# EAGLE design WLED MINI v0.92 (EAGLE 9.3.2)
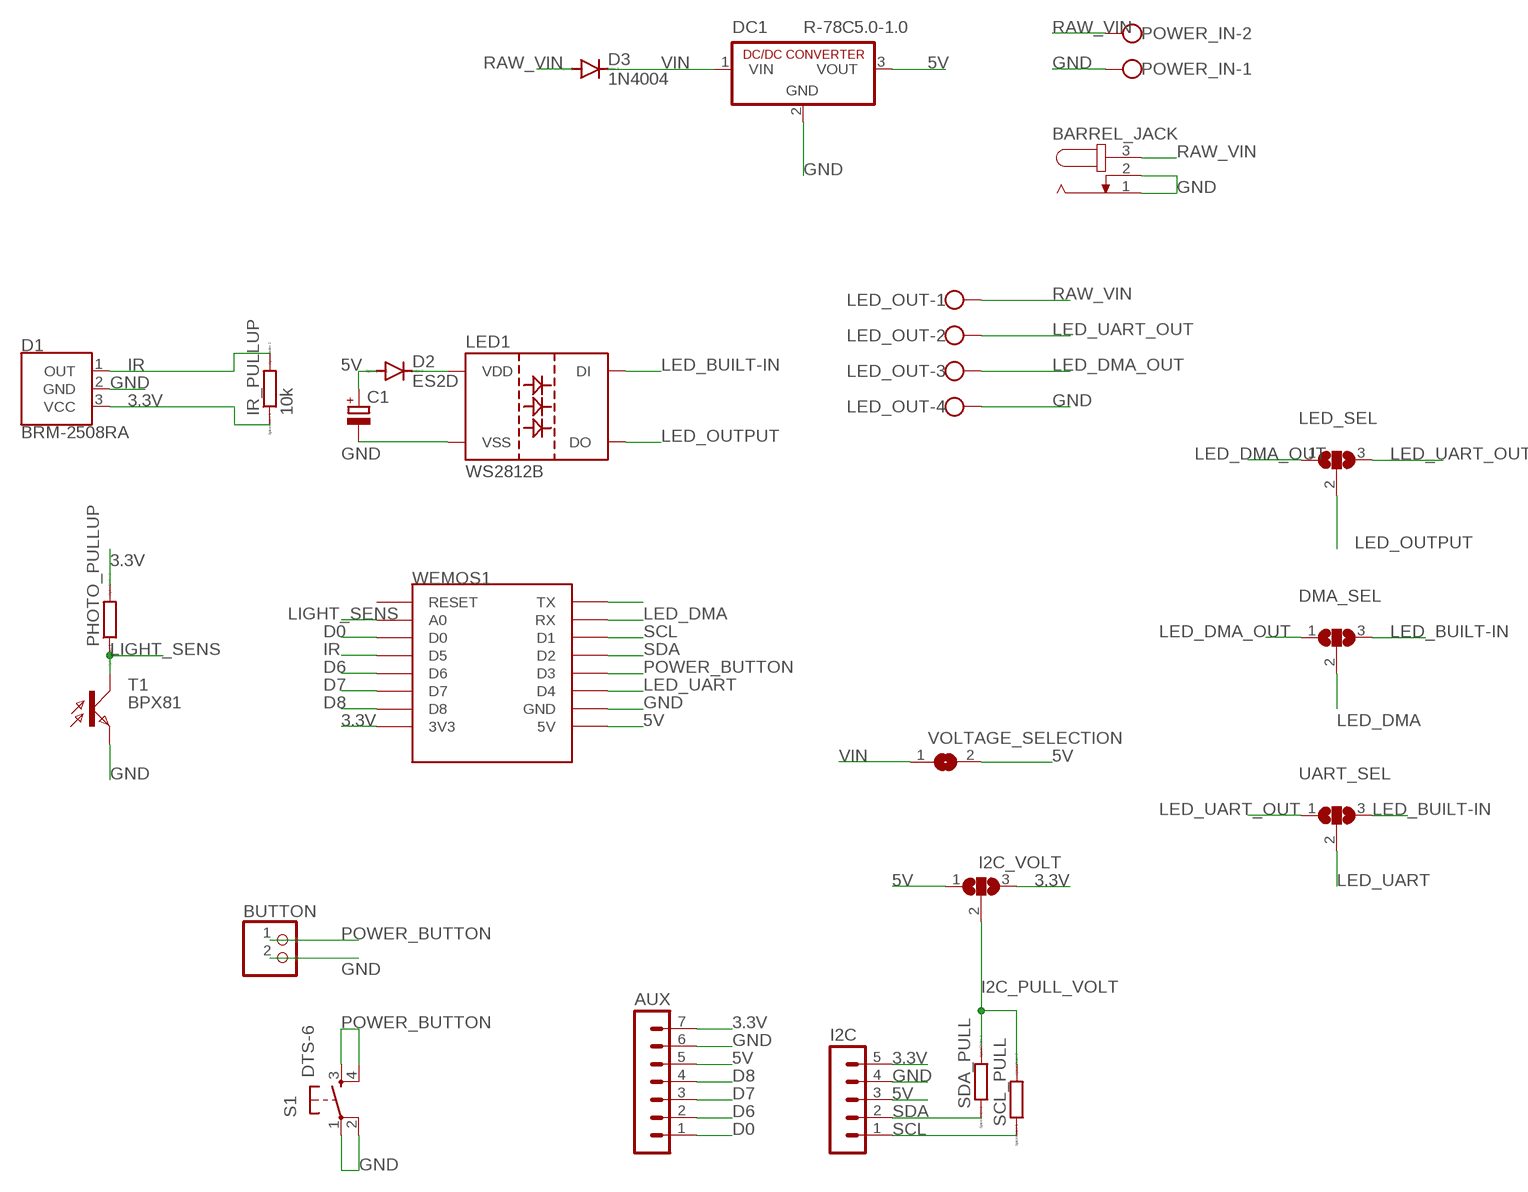
[diagram p0: schematic, sheet 1]

## Parts
AUX  MA07-1  [MA07-1]
BARREL_JACK  JACK-PLUG0  [SPC4077]
BUTTON  PINHD-1X2  [1X02]
C1  CPOL-EUE2.5-7  [E2,5-7]
D1  BRM-2508RA  [BRM-2508]
D2  ES2D  [SMB]
D3  1N4004  [DO41-10]
DC1  R-78C5.0-1.0  [SIP3]
DMA_SEL  SJ2W  [SJ_2]
I2C  MA05-1  [MA05-1]
I2C_VOLT  SJ2W  [SJ_2]
IR_PULLUP  10k  R0204/7  [0204/7]
LED1  WS2812B  [WS2812B]
LED_OUT  W237-4  [W237-4]
LED_SEL  SJ2W  [SJ_2]
PHOTO_PULLUP  R0204/7  [0204/7]
POWER_IN  W237-102  [W237-102]
S1  DTS-6  [DTS-6]
SCL_PULL  R0204/7  [0204/7]
SDA_PULL  R0204/7  [0204/7]
T1  BPX81  [BPX81]
UART_SEL  SJ2W  [SJ_2]
VOLTAGE_SELECTION  SJ  [SJ]
WEMOS1  WEMOS-D1-MINI  [WEMOS-D1-MINI]

## Nets
3.3V: AUX.7 D1.3(VCC) I2C.5 I2C_VOLT.3 IR_PULLUP.1 PHOTO_PULLUP.2 WEMOS1.3V3
5V [power]: AUX.5 C1.+ D2.A DC1.3(VOUT) I2C.3 I2C_VOLT.1 VOLTAGE_SELECTION.2 WEMOS1.5V
D0: AUX.1 WEMOS1.D0
D6: AUX.2 WEMOS1.D6
D7: AUX.3 WEMOS1.D7
D8: AUX.4 WEMOS1.D8
GND [power]: AUX.6 BARREL_JACK.1 BARREL_JACK.2 BUTTON.2 C1.- D1.2(GND) DC1.2(GND) I2C.4 LED1.3(VSS) LED_OUT.4 POWER_IN.1 S1.1 S1.2 T1.E WEMOS1.GND
I2C_PULL_VOLT: I2C_VOLT.2 SCL_PULL.2 SDA_PULL.2
IR: D1.1(OUT) IR_PULLUP.2 WEMOS1.D5
LED_BUILT-IN: DMA_SEL.3 LED1.4(DI) UART_SEL.3
LED_DMA: DMA_SEL.2 WEMOS1.RX
LED_DMA_OUT: DMA_SEL.1 LED_OUT.3 LED_SEL.1
LED_OUTPUT: LED1.2(DO) LED_SEL.2
LED_UART: UART_SEL.2 WEMOS1.D4
LED_UART_OUT: LED_OUT.2 LED_SEL.3 UART_SEL.1
LIGHT_SENS: PHOTO_PULLUP.1 T1.C WEMOS1.A0
N$1: WEMOS1.TX
N$2: D2.C LED1.1(VDD)
POWER_BUTTON: BUTTON.1 S1.3 S1.4 WEMOS1.D3
RAW_VIN [power]: BARREL_JACK.3 D3.A LED_OUT.1 POWER_IN.2
SCL: I2C.1 SCL_PULL.1 WEMOS1.D1
SDA: I2C.2 SDA_PULL.1 WEMOS1.D2
VIN: D3.C DC1.1(VIN) VOLTAGE_SELECTION.1
Unconnected: WEMOS1.RESET

## Library data of the parts
AUX = con-lstb:MA07-1: PIN HEADER; OC_FARNELL: unknown; OC_NEWARK: unknown
BARREL_JACK = con-jack:JACK-PLUG: DC POWER JACK Power Jack, DC, Right Angle, Through Hole, Rated 5A at 16VDC, PC Terminals Distributor: Farnell (www.Farnell.de) Drawing: 84N1161.pdf / 84N1162.pdf Manufacturer: SPC Technology (www.spctechnology.com) Type: SPC4077 / SPC 4078; OC_FARNELL: unknown; OC_NEWARK: unknown
BUTTON = pinhead:PINHD-1X2: PIN HEADER
C1 = rcl:CPOL-EU: POLARIZED CAPACITOR, European symbol; SPICEPREFIX: C
D1 = SparkFun-Sensors:BRM-2508: BRM-2508 IR Receiver Module 2.7V/5.5V IR Receiver with Low Power Consumption, High-immunity Against Ambient Light. Example Datasheet <http://www.sinoskysun.com/upload/20110512/201105120447164615.PDF>; PROD_ID: COMP-12059
D2 = diode:ES2D: DIODE super fast rectifier, 2 A
D3 = diode:1N4004: DIODE general purpose rectifier, 1 A
DC1 = dc-dc-converter:R-78C*-1.0: INNOLINE DC/DC-Converter 1.0 AMP SIP3 Single Output Source: Data sheet <http://www.mikrocontroller.net/attachment/150645/157764-da-01-en-DC_DC_WANDLER_R_78C5_0_1_0.pdf>
DMA_SEL I2C_VOLT LED_SEL UART_SEL = jumper:SJ2W: SMD solder JUMPER
I2C = con-lstb:MA05-1: PIN HEADER; OC_FARNELL: unknown; OC_NEWARK: unknown
IR_PULLUP PHOTO_PULLUP SCL_PULL SDA_PULL = eagle-ltspice:R: RESISTOR, European symbol; SPICEMODEL: NONE; SPICEPREFIX: R
LED1 = WS2812:WS2812B
LED_OUT = con-wago-500:W237-4: WAGO SCREW CLAMP; OC_FARNELL: unknown; OC_NEWARK: unknown
POWER_IN = con-wago-500:W237-102: WAGO SCREW CLAMP; MPN: 237-102; OC_FARNELL: unknown; OC_NEWARK: 70K9898
S1 = switch-tact:DTS-6
T1 = opto-trans-siemens:BPX81: PHOTO TRANSISTOR; OC_FARNELL: unknown; OC_NEWARK: unknown
VOLTAGE_SELECTION = jumper:SJ: SMD solder JUMPER
WEMOS1 = esp8266modules:WEMOS-D1-MINI: WeMos.cc D1 mini ESP8266 module

## Net classes
0 default: width 0.508 mm, clearance 0.254 mm
1 power: width 0.813 mm, clearance 0.33 mm

## Board
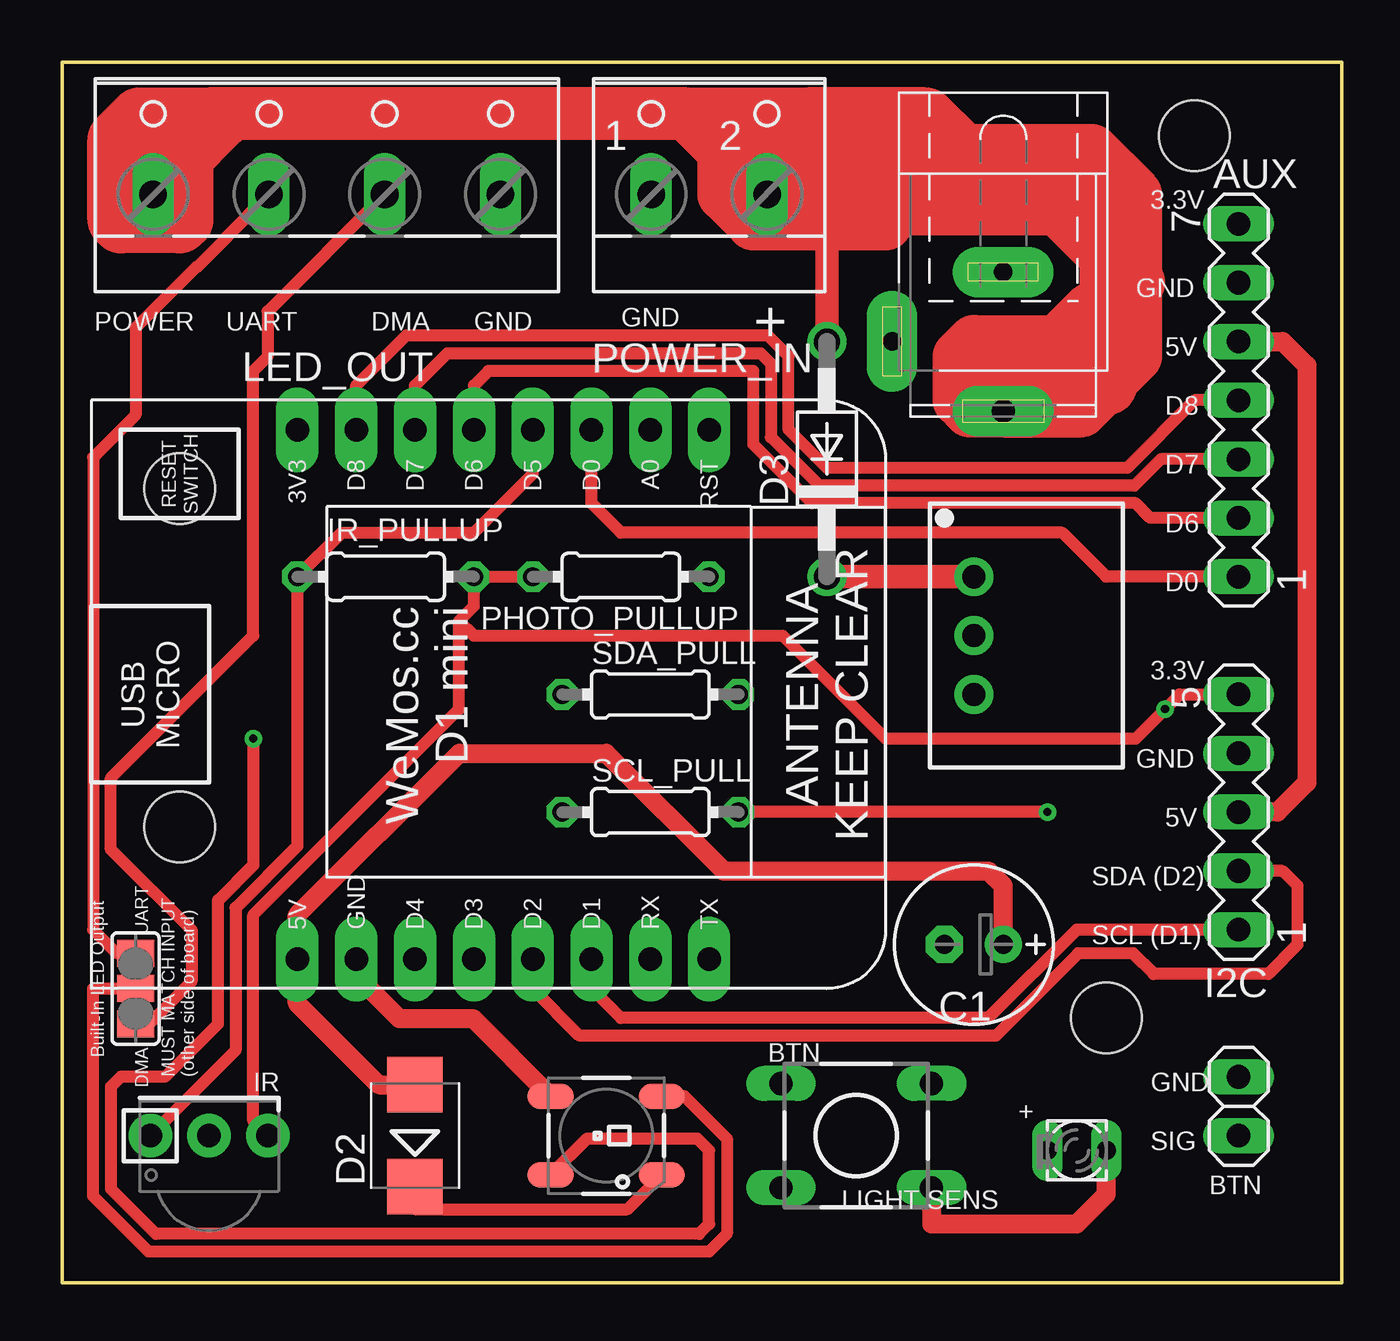
[diagram p1: board, top side]
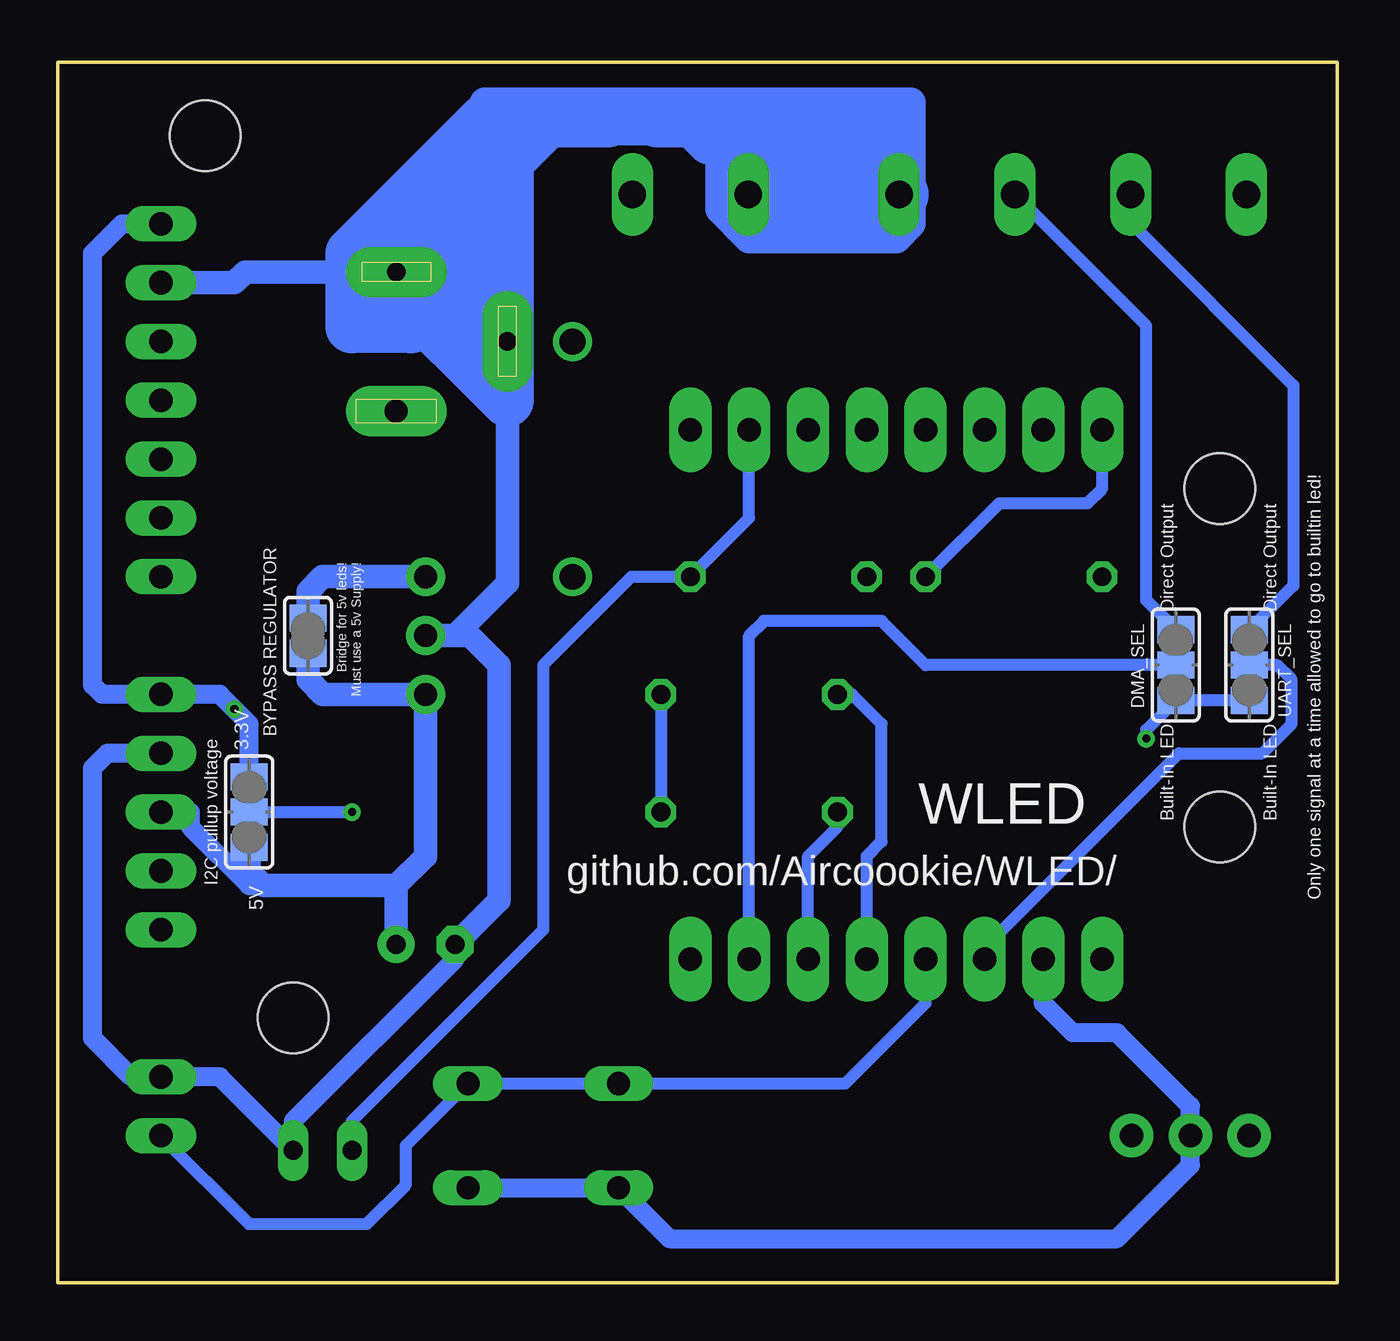
[diagram p2: board, bottom side, seen from below]

Size 55.24 x 52.7 mm. Coordinates in mm from the lower left corner, seen from the top.
Outline: 0,52.7 55.24,52.7 55.24,0 0,0 0,52.7
Copper layers (1*16): Top 0.035mm / dielectric 1.5mm / Bottom 0.035mm
Design rules "default": minimum track width 6mil, minimum drill 0.35mm, track to track 6mil, track to pad 6mil, pad to pad 6mil, via to via 6mil, smd to smd 6mil, copper to edge 40mil, drill to drill 6mil, minimum pad ring 10mil, minimum via ring 8mil, stop-mask expansion 4mil, vias tented up to drill 0mil, thermal gap 10mil
Holes 3.05 mm at 45.09,11.43 5.08,34.29 5.08,19.68 48.9,49.53

### Footprints (pad centres in the part's own frame; a part is rotated, then mirrored left to right if it is on the bottom)
MA07-1 = drill 1.016 long: 1 -7.62,0; 2 -5.08,0; 3 -2.54,0; 4 0,0; 5 2.54,0; 6 5.08,0; 7 7.62,0
SPC4077 = drill 0.8 pad 2.184 long: 1 -3,0; 2 0,-4.8 | drill 1 pad 2.184 long: 3 3,0
1X02 = drill 1.016 long: 1 -1.27,0; 2 1.27,0
E2,5-7 = drill 0.813 pad 1.6: + -1.27,0 | drill 0.813 pad 1.6 octagon: - 1.27,0
BRM-2508 = drill 1.016 pad 1.88: 1 -2.54,0; 2 0,0; 3 2.54,0
SMB = smd 2.4 x 2.4: A 2.2,0; C -2.2,0
DO41-10 = drill 1.118: A 5.08,0; C -5.08,0
SIP3 = drill 1 pad 1.676: 1 -2.54,0; 2 0,0; 3 2.54,0
SJ_2 = smd 1.168 x 1.6: 1 -1.524,0; 2 0,0; 3 1.524,0
MA05-1 = drill 1.016 long: 1 -5.08,0; 2 -2.54,0; 3 0,0; 4 2.54,0; 5 5.08,0
0204/7 = drill 0.813 octagon: 1 -3.81,0; 2 3.81,0
WS2812B = smd 2 x 1.1: 1 -2.4,1.7; 2 -2.4,-1.7; 3 2.4,-1.7; 4 2.4,1.7
W237-4 = drill 1.194 long: 1 -7.5,-1.27; 2 -2.5,-1.27; 3 2.5,-1.27; 4 7.5,-1.27
W237-102 = drill 1.194 long: 1 -2.5,-1.27; 2 2.5,-1.27
DTS-6 = drill 1 long: 1 -3.25,2.25; 2 3.25,2.25; 3 -3.25,-2.25; 4 3.25,-2.25
BPX81 = drill 0.813 long: C 1.27,0; E -1.27,0
SJ = smd 1.168 x 1.6: 1 -0.762,0; 2 0.762,0
WEMOS-D1-MINI = drill 1.016 pad 1.829 long: 3V3 -10.16,-10.16; 5V 12.7,-10.16; A0 -10.16,5.08; D0 -10.16,2.54; D1 12.7,2.54; D2 12.7,0; D3 12.7,-2.54; D4 12.7,-5.08; D5 -10.16,0; D6 -10.16,-2.54; D7 -10.16,-5.08; D8 -10.16,-7.62; GND 12.7,-7.62; RESET -10.16,7.62; RX 12.7,5.08; TX 12.7,7.62

### Placement (x,y rotation side)
AUX  50.8,38.1 90 top
BARREL_JACK  40.64,40.64 270 top
BUTTON  50.8,7.62 90 top
C1  39.37,14.61 180 top
D1  6.35,6.35 0 top
D2  15.24,6.35 90 top
D3  33.02,35.56 90 top
DC1  39.37,27.94 270 top
DMA_SEL  6.99,26.67 270 bottom
I2C  50.8,20.32 90 top
I2C_VOLT  46.99,20.32 90 bottom
IR_PULLUP  13.97,30.48 180 top
LED1  23.5,6.35 180 top
LED_OUT  11.43,48.26 0 top
LED_SEL  3.17,12.7 90 top
PHOTO_PULLUP  24.13,30.48 180 top
POWER_IN  27.94,48.26 0 top
S1  34.29,6.35 180 top
SCL_PULL  25.4,20.32 0 top
SDA_PULL  25.4,25.4 0 top
T1  43.81,5.71 180 top
UART_SEL  3.81,26.67 270 bottom
VOLTAGE_SELECTION  44.45,27.94 270 bottom
WEMOS1  20.32,26.67 270 top

### Tracks (layer width: path | path; a pad name or v marks a point on that pad's centre or on a via)
3.3V  (via drill 0.35)
  Top 0.508: PHOTO_PULLUP.2 IR_PULLUP.1 17.78,29.21 17.14,28.57 | 17.14,28.57 17.78,27.94 31.11,27.94 35.56,23.5 46.35,23.5 v47.62,24.77 48.26,25.4 I2C.5 | D1.3 8.26,6.99 8.26,15.88 17.14,24.77 17.14,28.57
  Bottom 0.508: IR_PULLUP.1 14.61,33.66 10.79,33.66 10.16,34.29 WEMOS1.3V3
  Bottom 0.813: I2C_VOLT.3 46.99,24.13 v47.62,24.77 48.26,25.4 I2C.5 53.34,25.4 53.75,25.81 53.75,44.45 52.48,45.72 AUX.7
5V
  Top 0.813: C1.+ 40.64,17.14 40.01,17.78 28.57,17.78 23.5,22.86 17.14,22.86 10.16,15.88 WEMOS1.5V 10.16,12.06 13.68,8.55 D2.A | AUX.5 52.7,40.64 53.75,39.6 53.75,21.59 52.48,20.32 I2C.3
  Bottom 0.813: I2C.3 49.53,20.32 49.53,19.68 46.99,17.14 45.72,17.14
  Bottom 1.016: VOLTAGE_SELECTION.2 44.45,26.04 43.81,25.4 DC1.3 39.37,18.41 40.64,17.14 | 40.64,17.14 C1.+ | 40.64,17.14 45.72,17.14 46.35,17.14 46.99,17.78 I2C_VOLT.1
D0
  Top 0.508: AUX.1 45.09,30.48 43.18,32.38 24.13,32.38 22.86,33.66 WEMOS1.D0
D6
  Top 0.508: WEMOS1.D6 17.78,38.73 18.41,39.37 29.84,39.37 29.84,36.2 32.38,33.66 46.35,33.66 46.99,33.02 AUX.2
D7
  Top 0.508: WEMOS1.D7 15.24,38.73 16.64,40.13 30.16,40.13 30.61,39.69 30.61,36.51 32.7,34.42 46.29,34.42 47.43,35.56 AUX.3
D8
  Top 0.508: WEMOS1.D8 12.7,38.73 14.86,40.89 30.48,40.89 31.37,40 31.37,36.83 33.02,35.18 45.97,35.18 48.9,38.1 AUX.4
GND
  Top 0.813: S1.1 37.54,2.54 43.81,2.54 45.09,3.81 T1.E | WEMOS1.GND 12.7,13.26 14.56,11.4 17.74,11.4 LED1.3
  Bottom 0.813: I2C.4 53.11,22.86 53.75,22.23 53.75,10.57 52.07,8.89 BUTTON.2 48.26,8.89 T1.E 45.09,6.99 38.1,13.97 C1.- | WEMOS1.GND 12.7,12.06 11.43,10.79 9.53,10.79 6.35,7.62 D1.2 6.35,5.08 9.53,1.91 28.84,1.91 S1.2 S1.1
  Bottom 1.016: 25.44,48.94 26.04,49.53 26.35,49.85 26.67,50.16 27.94,50.16 29.84,50.16 | 35.56,40.36 35.56,41.27 37.92,43.64 BARREL_JACK.1 47.16,43.64 47.62,43.18 AUX.6 | 35.56,40.01 35.56,40.36 | 35.56,40.36 BARREL_JACK.2 | 35.84,38.1 35.84,30.2 38.1,27.94 DC1.2 37.47,27.94 36.2,26.67 36.2,16.51 C1.-
  Bottom 1.27: 34.03,50.25 34.75,50.98 | 34.75,50.98 36.83,50.98 | 19.86,50.98 18.41,50.98 18.41,45.72 19.05,45.09 25.4,45.09 26.67,46.35 26.67,49.53 | 25.44,48.94 27.26,48.94 28.57,50.25 | 27.94,50.16 27.3,49.53 26.04,49.53 | 19.05,50.16 19.86,50.98 | 19.86,50.98 34.75,50.98
  Bottom 2.286: 36.74,47.54 39.6,44.68 39.6,45.49 38.73,46.35 | 36.74,47.54 35.84,48.44 | 35.84,48.44 34.03,50.25 28.57,50.25 26.76,50.25 26.35,49.85 | 25.44,48.94 POWER_IN.1 | BARREL_JACK.1 38.84,43.64 37.6,42.41 | 37.6,42.41 BARREL_JACK.2 | BARREL_JACK.2 35.84,48.44 | BARREL_JACK.2 35.84,38.1 40.64,42.9 BARREL_JACK.1 | 37.6,42.41 37.6,45.58 37.47,45.72 | 37.47,45.72 36.83,45.72 36.2,46.35 36.74,46.9 36.74,47.54 | BARREL_JACK.1 40.64,41.91 40.01,41.27 42.55,41.27 42.55,44.45 40.64,46.35 | 40.64,46.35 38.73,46.35 | 38.73,46.35 37.47,47.62 | 37.47,45.72 37.47,47.62 | 37.47,47.62 34.92,50.16 | 34.92,50.16 34.92,50.47 | 34.92,50.16 36.83,50.16 40.64,46.35 | 34.92,50.16 31.51,50.16 31.42,50.25 29.46,50.25 29.37,50.16 27.94,50.16 19.05,50.16
  Bottom 2.54: 19.05,47.11 LED_OUT.4 POWER_IN.1 24.17,45.72 19.68,45.72 19.68,46.48 19.05,47.11 | 19.05,47.11 19.05,48.9 19.09,48.94 25.44,48.94
I2C_PULL_VOLT  (via drill 0.35)
  Top 0.508: v42.55,20.32 SCL_PULL.2
  Bottom 0.508: I2C_VOLT.2 v42.55,20.32 | SDA_PULL.2 SCL_PULL.2
IR
  Top 0.508: WEMOS1.D5 20.32,34.92 17.78,32.38 12.06,32.38 IR_PULLUP.2 10.16,18.86 7.49,16.19 7.49,10.03 D1.1
LED_BUILT-IN  (via drill 0.35)
  Top 0.508: LED1.4 22.67,6.22 27.43,6.22 27.94,5.71 27.94,2.54 27.51,2.11 4.05,2.11 2.11,4.05 2.11,8.46 2.54,8.89 4.45,8.89 6.73,11.18 6.73,16.51 6.74,16.51 8.26,18.03 v8.26,23.5
  Bottom 0.508: UART_SEL.3 DMA_SEL.3 8.26,23.88 v8.26,23.5
LED_DMA
  Bottom 0.508: DMA_SEL.2 17.78,26.67 19.68,28.57 24.77,28.57 25.4,27.94 WEMOS1.RX
LED_DMA_OUT
  Top 0.508: LED_OUT.3 8.87,41.93 8.87,39.98 8.26,39.37 8.26,27.94 2.11,21.79 2.11,18.7 3.92,16.89 3.94,16.89 5.59,15.24 5.59,13.01 3.75,11.18 LED_SEL.1
  Bottom 0.508: DMA_SEL.1 8.26,29.46 8.26,41.31 LED_OUT.3
LED_OUTPUT
  Top 0.508: LED_SEL.2 1.35,12.7 1.35,3.73 3.73,1.35 27.94,1.35 28.7,2.11 28.7,6.22 26.88,8.05 LED1.2
LED_UART
  Bottom 0.508: UART_SEL.2 2.62,26.67 1.98,26.04 1.98,24.13 3.25,22.86 6.84,22.86 15.24,14.46 WEMOS1.D4
LED_UART_OUT
  Top 0.508: LED_OUT.2 7.11,45.17 7.11,45.13 5.85,43.87 5.81,43.87 3.17,41.23 3.17,37.47 1.35,35.64 1.35,15.24 2.36,14.22 LED_SEL.3
  Bottom 0.508: LED_OUT.2 8.93,45.76 1.91,38.73 1.91,30.1 UART_SEL.1
LIGHT_SENS
  Bottom 0.508: WEMOS1.A0 25.4,33.02 PHOTO_PULLUP.1 30.48,30.48 34.29,26.67 34.29,15.24 42.55,6.99 T1.C
N$2
  Top 0.508: D2.C 15.24,3.17 24.42,3.17 LED1.1
POWER_BUTTON
  Bottom 0.508: WEMOS1.D3 17.78,12.06 21.25,8.6 S1.4 S1.3 40.22,5.92 40.22,4.24 41.91,2.54 46.99,2.54 BUTTON.1
RAW_VIN
  Top 1.016: LED_OUT.1 3.93,48.38 6.35,50.8 | D3.A 33.02,45.72 34.29,46.99
  Top 1.27: LED_OUT.1 3.17,47.74 3.17,48.9 5.26,50.98 32.21,50.98 33.02,50.16 32.38,49.53 | 3.81,47.93 3.17,47.3 3.17,45.72
  Top 2.286: POWER_IN.2 26.96,50.47 | 26.96,50.47 6.35,50.47 3.93,48.05 | 3.93,48.05 LED_OUT.1 5.08,46.99 | 46.35,46.99 46.35,43.18 46.35,40.01 43.99,37.64 BARREL_JACK.3 39.2,37.64 38.73,38.1 38.73,40.01 | 46.35,46.99 43.81,46.99 | 36.83,46.99 34.29,46.99 POWER_IN.2 | 45.09,40.01 41.27,40.01 | 41.27,40.01 40.01,38.73 43.81,38.73 45.09,40.01 | 45.09,41.27 45.09,40.01 | 38.73,40.01 41.27,40.01 | 46.35,46.99 44.45,48.9 38.73,48.9 31.75,48.9 30.18,50.47 26.96,50.47 | POWER_IN.2 28.57,46.99 | 28.57,46.99 28.57,48.9 29.21,49.53 | 28.57,46.99 29.84,45.72 35.56,45.72 36.2,46.35 | 36.2,46.35 36.83,46.99 | 5.08,46.99 5.08,48.26 6.99,50.16 | 3.93,48.05 3.81,47.93 3.81,45.72 5.08,45.72 5.08,46.99 | 38.73,40.01 39.37,40.64 44.45,40.64 45.09,41.27 | 45.09,41.27 45.09,45.72 44.45,46.35 | 44.45,46.35 43.81,46.99 | 43.81,46.99 36.83,46.99 | 44.45,46.35 36.2,46.35
  Top 2.54: 45.14,38.73 43.81,38.73 | 46.35,43.18 43.18,46.35 43.18,48.26 | 41.27,40.01 42.55,40.01 44.45,41.91 44.45,40.64 | 38.73,48.9 37.29,50.34 32.21,50.34 | 5.08,45.72 2.54,45.72 2.36,45.9 2.36,49.35 3.35,50.34 5.26,50.34 5.26,45.9 5.08,45.72
SCL
  Top 0.508: WEMOS1.D1 22.86,12.7 24.13,11.43 40.01,11.43 43.81,15.24 I2C.1
  Bottom 0.508: WEMOS1.D1 22.86,18.41 21.59,19.68 SCL_PULL.1
SDA
  Top 0.508: WEMOS1.D2 20.32,12.7 22.35,10.67 40.32,10.67 43.88,14.22 46.24,14.22 47.13,13.34 52.07,13.34 53.34,14.61 53.34,17.14 52.7,17.78 I2C.2
  Bottom 0.508: WEMOS1.D2 20.32,18.41 19.68,19.05 19.68,24.13 20.95,25.4 SDA_PULL.1
VIN
  Top 1.016: DC1.1 D3.C
  Bottom 1.016: VOLTAGE_SELECTION.1 44.45,29.84 43.81,30.48 DC1.1

### Text on the board
tNames: 3.3V | GND | POWER | UART | DMA | GND | GND | + | 5V | D8 | D7 | D6 | D0 | 3.3V | GND | 5V | Built-In LED Output | UART | SDA (D2) | SCL (D1) | DMA | BTN | MUST MATCH INPUT / (other side of board) | IR | GND | + | SIG | BTN | LIGHT SENS
bNames: Only one signal at a time allowed to go to builtin led! | Direct Output | Direct Output | BYPASS REGULATOR | Bridge for 5v leds! / Must use a 5v Supply! | 3.3V | Built-In LED | Built-In LED | I2C pullup voltage | WLED | github.com/Aircoookie/WLED/ | 5V